# Altium schematic sheet PMOS Load Switch.SchDoc
size A4; Organization: TESLA Motors, INC; Address1: 3500 Deer Creek Road; Address2: Palo Alto, CA; Address4: U.S.A.; SheetNumber: 16; SheetTotal: 21
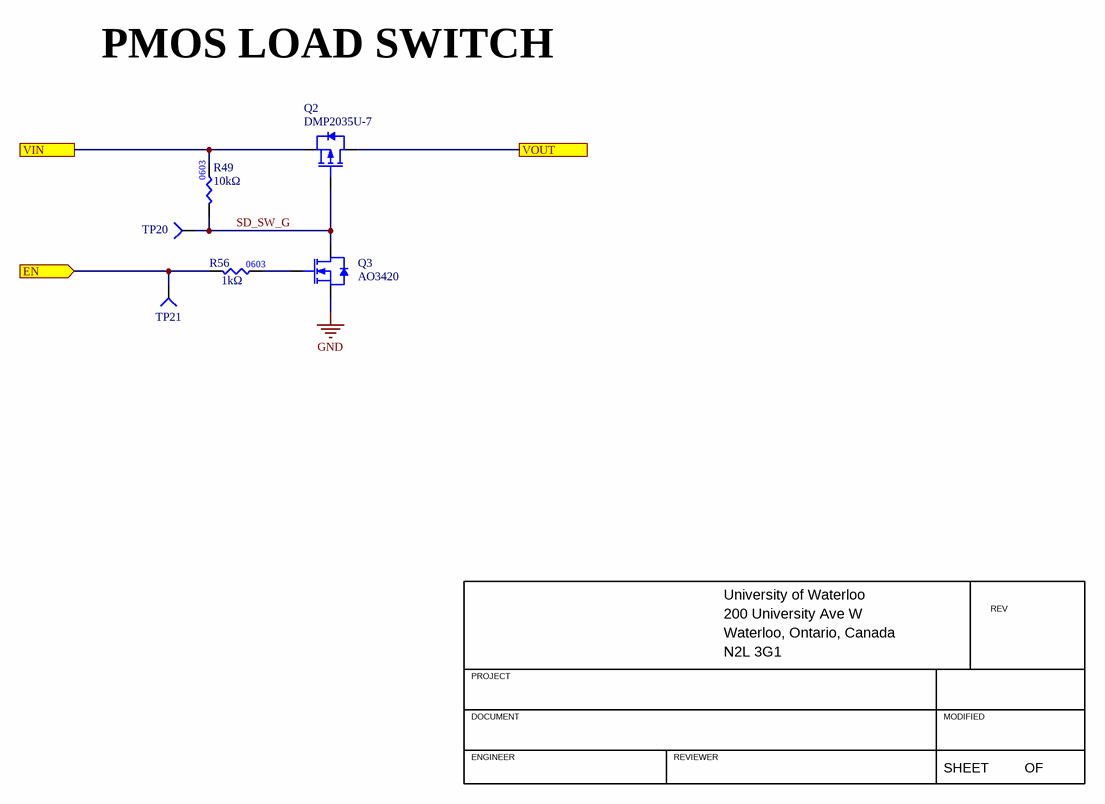
[diagram p0: PMOS Load Switch.SchDoc]

## Parts
Q2  Manufacturer Part Number 1: DMP2035U-7  [DIO-INC_SOT23]  (hidden comment: PMOS_20V_3.6A)
Q3  Manufacturer Part Number 1: AO3420  [SOT23-3]  (hidden comment: NMOS_20V_6A)
R49  value 10kΩ  [RES0603]  (hidden comment: RES_10kΩ_0603_1%)
R56  value 1kΩ  [RES0603]  (hidden comment: RES_1kΩ_0603_1%)
TP20  TESTPOINT_1MM_CIRCLE  [TESTPOINT_CIRCLE_1MM]  (value not drawn)  (no BOM)
TP21  TESTPOINT_1MM_CIRCLE  [TESTPOINT_CIRCLE_1MM]  (value not drawn)  (no BOM)

## Ports
EN (in, see SD Card Interface[2B]), VIN (see SD Card Interface[2B]), VOUT (see SD Card Interface[3B])

## Nets
GND: Q3.2(SOURCE)
EN: R56.1 TP21.1(=value) ; port EN
SD_SW_G: Q2.1(Gate) Q3.3(DRAIN) R49.1 TP20.1(=value)
VIN: Q2.2(Source) R49.2 ; port VIN
VOUT: Q2.3(Drain) ; port VOUT
NetQ3_1: Q3.1(GATE) R56.2

## Notes on the sheet
- PMOS LOAD SWITCH
- University of Waterloo
- 200 University Ave W
- REV
- PROJECT
- Waterloo, Ontario, Canada
- N2L 3G1
- DOCUMENT
- ENGINEER
- REVIEWER
- MODIFIED
- SHEET
- OF

## Library data of the parts
Q2 = PMOS_20V_3.6A: MOSFET P-CH 20V 3.6A SOT23-3; Manufacturer 1: Diodes Incorporated; Supplier 1: Digi-Key; Supplier Part Number 1: DMP2035U-7DICT-ND
Q3 = NMOS_20V_6A: MOSFET N-CH 20V 6A SOT-23; Manufacturer 1: Alpha & Omega; Supplier 1: Digi-Key; Supplier Part Number 1: 785-1014-2-ND
R49 = RES_10kΩ_0603_1%: RES 10K OHM 1% 1/8W 0603; Manufacturer 1: Stackpole Electronics Inc; Manufacturer Part Number 1: RNCP0603FTD10K0; Supplier Part Number 1: RNCP0603FTD10K0CT-ND; Supplier 1: Digi-Key; Mounting Type: SMD; Package: 0603
R56 = RES_1kΩ_0603_1%: RES 1K OHM 1% 1/8W 0603; Manufacturer 1: Stackpole Electronics Inc; Manufacturer Part Number 1: RNCP0603FTD1K00; Supplier Part Number 1: RNCP0603FTD1K00CT-ND; Supplier 1: Digi-Key; Mounting Type: SMD; Package: 0603
TP20 TP21 = TESTPOINT_1MM_CIRCLE: TESTPOINT 1MM CIRCLE